# EAGLE design circle_color (EAGLE 7.4.0)
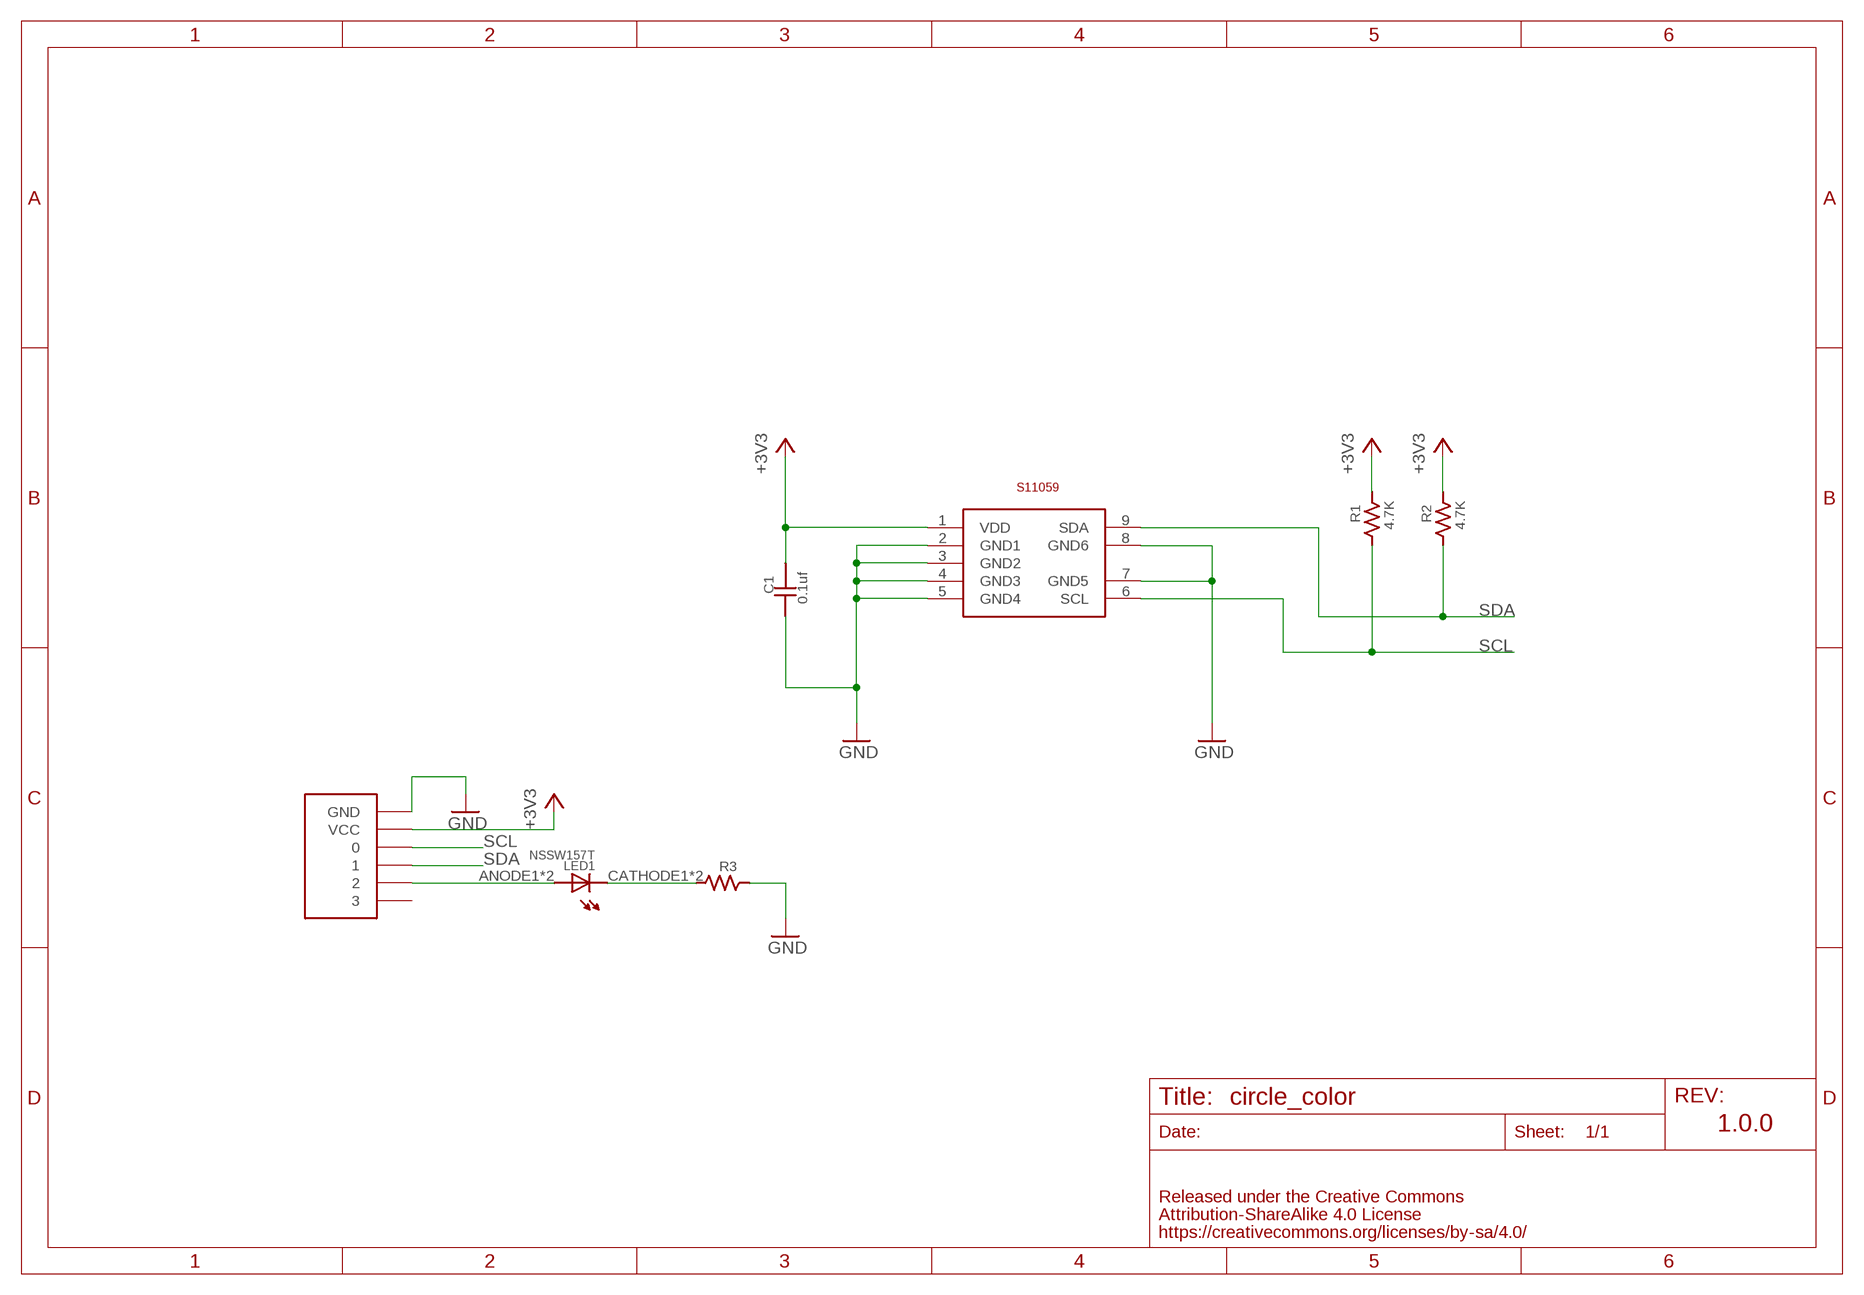
[diagram p0: schematic, sheet 1]

## Parts
C1  0.1uf  CAPACITOR0402  [0402]
LED1  NSSW157T  [NSSW157T]
R1  4.7K  RESISTOR-0402  [0402]
R2  4.7K  RESISTOR-0402  [0402]
R3  RESISTOR-0402  [0402]
S1  HAMAMATSU-S11059  [HAMAMATSU-S11059]
U$4  FABO-NANO  [FABO-NANO]

## Nets
+3V3: C1.P$2 R1.P$2 R2.P$2 S1.1(VDD) U$4.VCC
GND: C1.P$1 R3.P$2 S1.2(GND1) S1.3(GND2) S1.4(GND3) S1.5(GND4) S1.7(GND5) S1.8(GND6) U$4.GND
N$1: LED1.ANODE1(ANODE) LED1.ANODE2(ANODE) U$4.2
N$2: LED1.CATHODE1(CATHODE) LED1.CATHODE2(CATHODE) R3.P$1
SCL: R1.P$1 S1.6(SCL) U$4.0
SDA: R2.P$1 S1.9(SDA) U$4.1
Unconnected: U$4.3

## Notes on the sheet
- 1.0.0

## Library data of the parts
C1 = FaBo-Capacitor:CAPACITOR: CAPACITOR
LED1 = FaBo-LED:NSSW157T
R1-R3 = FaBo-Resistors:RESISTOR: RESISTOR
S1 = gclueSensor:HAMAMATSU-S11059
U$4 = FaBo-Template:FABO-NANO

## Board
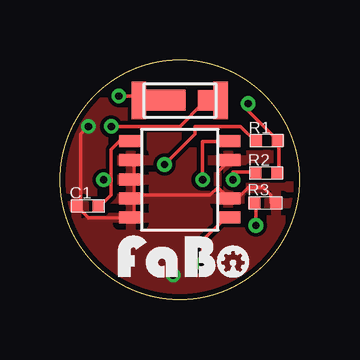
[diagram p1: board, top side]
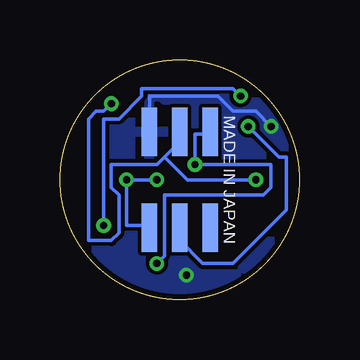
[diagram p2: board, bottom side, seen from below]

Size 10 x 10 mm. Coordinates in mm from the lower left corner, seen from the top.
Copper layers (1*16): Top 0.035mm / dielectric 1.5mm / Bottom 0.035mm
Design rules "Elecrow_2-layer_eagle_rule": minimum track width 6mil, minimum drill 12mil, track to track 6mil, track to pad 6mil, pad to pad 6mil, via to via 6mil, smd to smd 0mil, copper to edge 10mil, drill to drill 10mil, minimum pad ring 10mil, minimum via ring 6mil, stop-mask expansion 2mil, vias tented up to drill 100mil, thermal gap 10mil

### Footprints (pad centres in the part's own frame; a part is rotated, then mirrored left to right if it is on the bottom)
0402 = smd 0.5 x 0.5: P$1 -0.46,0; P$2 0.46,0
NSSW157T = smd 0.6 x 1.55: ANODE1 1.7,0.01; CATHODE2 -1.71,0.01 | smd 0.64 x 0.86: ANODE2 1.08,0.01 | smd 1.66 x 0.86: CATHODE1 -0.59,0.02
HAMAMATSU-S11059 = smd 1 x 0.5: 1 -2.04,1.62; 2 -2.04,0.82; 3 -2.04,0.02; 4 -2.04,-0.78; 5 -2.04,-1.58; 6 2.03,-1.58; 7 2.03,-0.78; 8 2.03,0.82; 9 2.03,1.62
FABO-NANO = smd 0.635 x 2.032 bottom: 0 -1.27,2; 1 1.27,-2; 2 0,-2; 3 -1.27,-2; GND 1.27,2; VCC 0,2

### Placement (x,y rotation side)
C1  1.16,3.91 0 top
LED1  5,8.3 0 top
R1  8.63,6.63 0 top
R2  8.61,5.28 0 top
R3  8.58,4.03 0 top
S1  5,5 0 top
U$2  [LOGO_FABO_S]  5.22,0.92 0 top
U$4  5,5 0 top

### Tracks (layer width: path | path; a pad name or v marks a point on that pad's centre or on a via)
+3V3  (via drill 0.3)
  Top 0.152: 2.14,5 2.14,6.27 2.46,6.59 2.78,6.59 S1.1 | 2.14,5 2.14,4.37 1.82,4.05 C1.P$2 | 9.13,6.59 9.13,5.32 R2.P$2 | 9.13,6.59 7.86,7.86 v7.86,8.18 | 9.13,6.59 R1.P$2 | v1.82,5 2.14,5
  Bottom 0.152: v7.86,8.18 8.18,7.86 8.49,7.86 8.81,7.54 8.81,2.46 7.86,2.46 7.54,2.78 7.54,4.37 7.86,4.68 7.86,5.63 5.95,5.63 5.63,5.95 | 5.63,5.95 5,6.59 U$4.VCC | v1.82,5 4.68,5 5.63,5.95
GND  (via drill 0.3)
  Top 0.152: R3.P$2 8.81,4.05 8.81,4.37 8.49,4.68 7.86,4.68 7.22,4.05 S1.7 6.91,4.37 6.59,4.68 | 6.59,4.68 6.59,5.32 6.91,5.63 S1.8 | 3.09,5 3.09,4.37 | 3.09,5 3.09,5.63 S1.2 | 3.09,5 S1.3 | v1.19,7.22 0.87,6.91 0.87,4.05 C1.P$1 0.87,3.73 1.19,3.41 2.78,3.41 S1.5 3.09,3.41 3.09,4.05 S1.4 3.09,4.37 | 6.59,4.68 6.27,4.37 3.09,4.37
  Bottom 0.152: U$4.GND 6.27,8.49 3.41,8.49 2.78,7.86 1.82,7.86 v1.19,7.22
  other vias: 4.72,1.02
  pour Bottom: -0.08,-0.08 9.92,-0.08 9.92,9.92 -0.08,9.92
  pour Top: -0.08,-0.08 9.92,-0.08 9.92,9.92 -0.08,9.92
N$1  (via drill 0.3)
  Top 0.152: LED1.ANODE1 6.59,8.49 6.27,8.49 LED1.ANODE2 5.95,8.18 5,7.22 v2.14,7.22
  Bottom 0.152: v2.14,7.22 0.87,5.95 0.55,5.95 0.55,3.73 2.78,1.51 4.05,1.51 5,2.46 U$4.2
N$2  (via drill 0.3)
  Top 0.152: v8.18,3.09 8.18,4.05 R3.P$1 | v2.46,8.49 3.09,8.49 LED1.CATHODE2 3.41,8.49 4.37,8.49 LED1.CATHODE1
  Bottom 0.152: v8.18,3.09 8.18,7.54 7.54,7.54 6.59,8.49 6.59,8.81 2.78,8.81 v2.46,8.49
SCL  (via drill 0.3)
  Top 0.152: v4.37,5.63 5.63,6.91 5.63,7.22 7.54,7.22 8.18,6.59 R1.P$1 | v5.95,1.51 5.95,2.46 6.91,3.41 S1.6
  Bottom 0.152: U$4.0 3.73,6.91 4.37,6.91 v4.37,5.63 1.19,5.63 1.19,4.68 1.51,4.37 5.63,4.37 5.63,1.82 v5.95,1.51
SDA  (via drill 0.3)
  Top 0.152: v7.22,5 7.22,5.32 8.18,5.32 R2.P$1 | v5.95,5 5.95,6.59 6.91,6.59 S1.9
  Bottom 0.152: U$4.1 6.27,3.09 7.22,3.09 v7.22,5 v5.95,5

### Text on the board
bPlace: MADE IN JAPAN